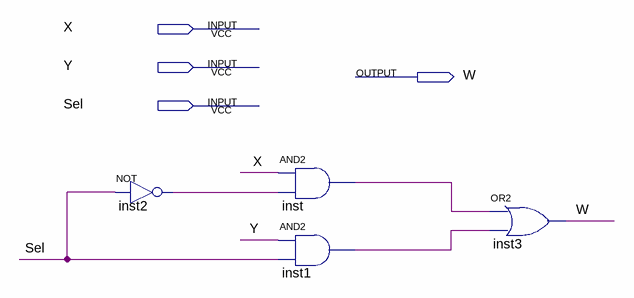
[diagram p0: schematic sheet]
// Quartus schematic MUX21.bdf as structural Verilog: 4 symbols, 4 pins
module MUX21 (
  input  X,
  input  Y,
  input  Sel,
  output W
);

  wire inst1_out, inst2_out, inst_out;

  not inst2 (inst2_out, Sel);
  and inst (inst_out, X, inst2_out);
  and inst1 (inst1_out, Y, Sel);
  or inst3 (W, inst_out, inst1_out);
endmodule
